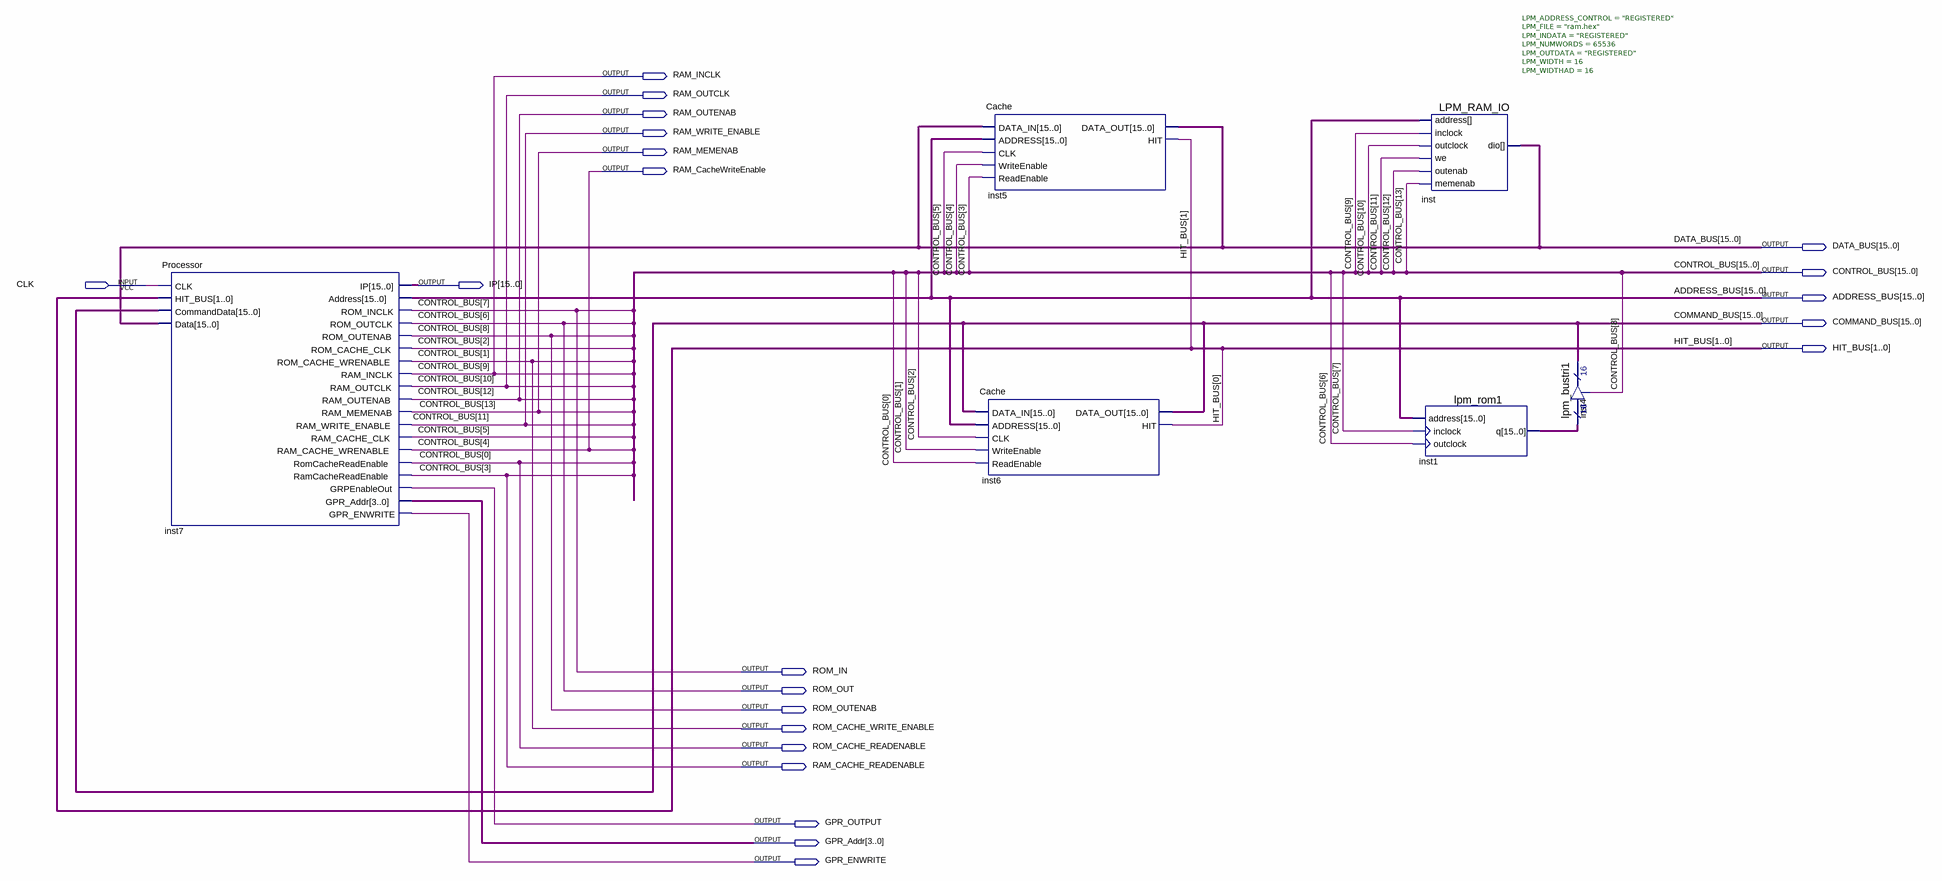
[diagram p0: schematic sheet]
// Quartus schematic MainSchema.bdf as structural Verilog: 6 symbols, 22 pins
module MainSchema (
  input  CLK,
  output RAM_INCLK,
  output RAM_OUTCLK,
  output RAM_OUTENAB,
  output RAM_WRITE_ENABLE,
  output RAM_MEMENAB,
  output RAM_CacheWriteEnable,
  output [15:0] DATA_BUS,
  output [15:0] CONTROL_BUS,
  output [15:0] IP,
  output [15:0] ADDRESS_BUS,
  output [15:0] COMMAND_BUS,
  output [1:0] HIT_BUS,
  output ROM_IN,
  output ROM_OUT,
  output ROM_OUTENAB,
  output ROM_CACHE_WRITE_ENABLE,
  output ROM_CACHE_READENABLE,
  output RAM_CACHE_READENABLE,
  output GPR_OUTPUT,
  output [3:0] GPR_Addr,
  output GPR_ENWRITE
);

  wire [15:0] inst1_q;

  Processor inst7 (
    .CLK(CLK), .HIT_BUS(HIT_BUS), .CommandData(COMMAND_BUS), .Data(DATA_BUS), .IP(IP), .Address(ADDRESS_BUS),
    .ROM_INCLK(CONTROL_BUS[7]), .ROM_OUTCLK(CONTROL_BUS[6]), .ROM_OUTENAB(CONTROL_BUS[8]),
    .ROM_CACHE_CLK(CONTROL_BUS[2]), .ROM_CACHE_WRENABLE(CONTROL_BUS[1]), .RAM_INCLK(CONTROL_BUS[9]),
    .RAM_OUTCLK(CONTROL_BUS[10]), .RAM_OUTENAB(CONTROL_BUS[12]), .RAM_MEMENAB(CONTROL_BUS[13]),
    .RAM_WRITE_ENABLE(CONTROL_BUS[11]), .RAM_CACHE_CLK(CONTROL_BUS[5]), .RAM_CACHE_WRENABLE(CONTROL_BUS[4]),
    .RomCacheReadEnable(CONTROL_BUS[0]), .RamCacheReadEnable(CONTROL_BUS[3]), .GRPEnableOut(GPR_OUTPUT),
    .GPR_Addr(GPR_Addr), .GPR_ENWRITE(GPR_ENWRITE));
  Cache inst5 (
    .DATA_IN(DATA_BUS), .ADDRESS(ADDRESS_BUS), .CLK(CONTROL_BUS[5]), .WriteEnable(CONTROL_BUS[4]),
    .ReadEnable(CONTROL_BUS[3]), .HIT(HIT_BUS[1]), .DATA_OUT(DATA_BUS));
  Cache inst6 (
    .DATA_IN(COMMAND_BUS), .ADDRESS(ADDRESS_BUS), .CLK(CONTROL_BUS[2]), .WriteEnable(CONTROL_BUS[1]),
    .ReadEnable(CONTROL_BUS[0]), .HIT(HIT_BUS[0]), .DATA_OUT(COMMAND_BUS));
  LPM_RAM_IO #(.LPM_ADDRESS_CONTROL("REGISTERED"), .LPM_FILE("ram.hex"), .LPM_INDATA("REGISTERED"), .LPM_NUMWORDS(65536), .LPM_OUTDATA("REGISTERED"), .LPM_WIDTH(16), .LPM_WIDTHAD(16)) inst (
    .address(ADDRESS_BUS), .outclock(CONTROL_BUS[10]), .memenab(CONTROL_BUS[13]), .inclock(CONTROL_BUS[9]),
    .we(CONTROL_BUS[11]), .outenab(CONTROL_BUS[12]), .dio(DATA_BUS));
  lpm_rom1 inst1 (.address(ADDRESS_BUS), .inclock(CONTROL_BUS[7]), .outclock(CONTROL_BUS[6]), .q(inst1_q));
  lpm_bustri1 inst4 (.enabledt(CONTROL_BUS[8]), .data(inst1_q), .tridata(COMMAND_BUS));

  assign RAM_CACHE_READENABLE = CONTROL_BUS[3];
  assign RAM_CacheWriteEnable = CONTROL_BUS[4];
  assign RAM_INCLK = CONTROL_BUS[9];
  assign RAM_MEMENAB = CONTROL_BUS[13];
  assign RAM_OUTCLK = CONTROL_BUS[10];
  assign RAM_OUTENAB = CONTROL_BUS[12];
  assign RAM_WRITE_ENABLE = CONTROL_BUS[11];
  assign ROM_CACHE_READENABLE = CONTROL_BUS[0];
  assign ROM_CACHE_WRITE_ENABLE = CONTROL_BUS[1];
  assign ROM_IN = CONTROL_BUS[7];
  assign ROM_OUT = CONTROL_BUS[6];
  assign ROM_OUTENAB = CONTROL_BUS[8];
endmodule
